# Altium schematic sheet EEPROM.SchDoc: Dahlia Carrier Board
size A3; Organization: Toradex AG; Address1: Ebenaustrasse 10; Address2: Horw; Address3: 6048; Address4: Switzerland; DocumentNumber: 16; Revision: V1.1; SheetNumber: 16; SheetTotal: 21; PageSetup: Record=PageOptions|CenterHorizontal=True|CenterVertical=True|PrintScale=0.71|XCorrection=1.00|YCorrection=1.00|PrintKind=1|BorderSize=5000000|LeftOffset=0|BottomOffset=0|Orientation=2|PaperLength=1000|PaperWidth=1000|Scale=100|PaperSource=15|PrintQuality=600|MediaType=1|DitherType=10|PaperKind=A4|PrintScaleMode=1
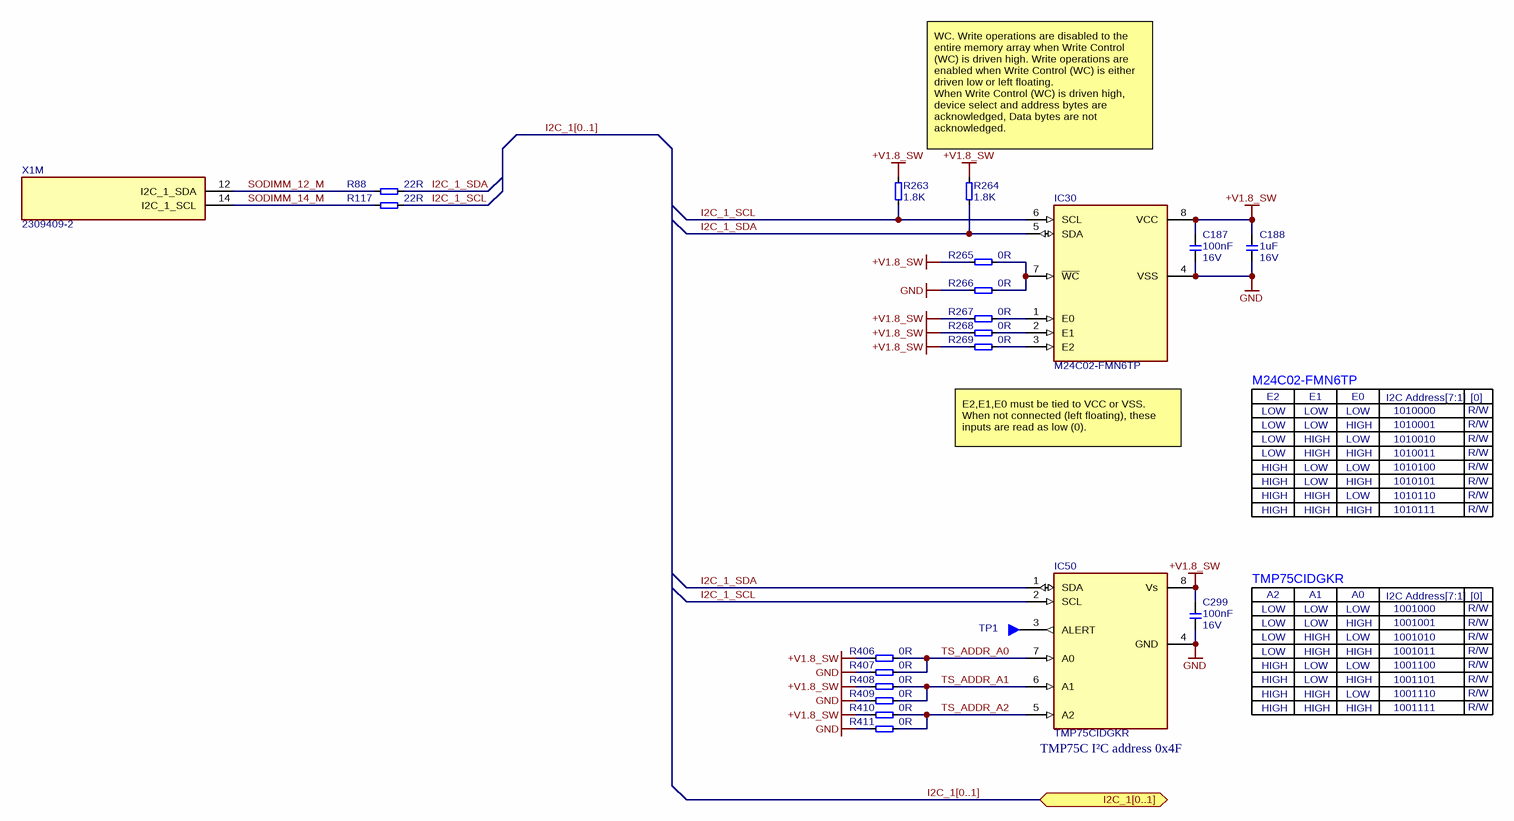
[diagram p0: EEPROM.SchDoc]

## Parts
C187  Rating: 16V  [CAPC1005X60N]  (hidden comment: 100nF)
C188  Rating: 16V  [CAPC1005X60N]  (hidden comment: 1uF)
C299  Rating: 16V  [CAPC1005X60N]  (hidden comment: 100nF)
IC30  M24C02-FMN6TP  [IC-SOIC-8N]
IC50  TMP75CIDGKR  [IC-TSOP65P490X110-8N]
R88  22R  [RESC1005X40N]
R117  22R  [RESC1005X40N]
R263  1.8K  [RESC1005X40N]
R264  1.8K  [RESC1005X40N]
R265  0R  [T_RESC0603X30N]
R266  0R  [T_RESC0603X30N]
R267  0R  [T_RESC0603X30N]
R268  0R  [T_RESC0603X30N]
R269  0R  [T_RESC0603X30N]
R406  0R  [T_RESC0603X30N]
R407  0R  [T_RESC0603X30N]
R408  0R  [T_RESC0603X30N]
R409  0R  [T_RESC0603X30N]
R410  0R  [T_RESC0603X30N]
R411  0R  [T_RESC0603X30N]
TP1  Testpin-SMD  [T_TP-SMD]  (value not drawn)  (no BOM)
X1  2309409-2  [CON-TE-2309409-2-SOLDERABLE-STANDOFFS]  (part M of 23)

## Ports
I2C_1[0..1] (bidir)

## Nets
+V1.8_SW: C187.2 C188.2 C299.2 IC30.8(VCC) IC50.8(Vs) R263.1 R264.1 R265.1 R267.1 R268.1 R269.1 R406.1 R408.1 R410.1
GND: C187.1 C188.1 C299.1 IC30.4(VSS) IC50.4(GND) R266.1 R407.1 R409.1 R411.1
I2C_1_SCL: IC30.6(SCL) IC50.2(SCL) R117.2 R263.2
I2C_1_SDA: IC30.5(SDA) IC50.1(SDA) R88.2 R264.2
SODIMM_12_M: R88.1 X1.12(I2C_1_SDA)
SODIMM_14_M: R117.1 X1.14(I2C_1_SCL)
TS_ADDR_A0: IC50.7(A0) R406.2 R407.2
TS_ADDR_A1: IC50.6(A1) R408.2 R409.2
TS_ADDR_A2: IC50.5(A2) R410.2 R411.2
NetIC30_1: IC30.1(E0) R267.2
NetIC30_2: IC30.2(E1) R268.2
NetIC30_3: IC30.3(E2) R269.2
NetIC30_7: IC30.7(~{WC}) R265.2 R266.2
NetIC50_3: IC50.3(ALERT) TP1.1

## Buses and harness runs
bus I2C_1[0..1] = port I2C_1[0..1]

## Notes on the sheet
- WC. Write operations are disabled to the entire memory array when Write Control (WC) is driven high. Write operations are enabled when Write Control (WC) is either driven low or left floating.
  When Write Control (WC) is driven high, device select and address bytes are acknowledged, Data bytes are not acknowledged.
- E2,E1,E0 must be tied to VCC or VSS. When not connected (left floating), these inputs are read as low (0).
- M24C02-FMN6TP
- LOW
- E2
- HIGH
- E1
- E0
- I2C Address[7:1]
- 1010000
- 1010001
- 1010010
- R/W
- [0]
- 1010011
- 1010100
- 1010101
- 1010110
- 1010111
- TMP75CIDGKR
- A2
- A1
- A0
- 1001000
- 1001001
- 1001010
- 1001011
- 1001100
- 1001101
- 1001110
- 1001111
- (near IC50) TMP75C I²C address 0x4F
- Title
- Size:
- Date:
- A3
- Number:
- Time:
- Revision:
- Sheet
- of
- File:

## Library data of the parts
C187 C299 = C-X7R-100nF-16V-10%-0402: Capacitor Ceramic X7R 100nF 16V 10% 0402; Tolerance: 10%; Type: X7R; Value: 100nF
C188 = C-X5R-1uF-16V-20%-0402: Capacitor Ceramic X5R 1uF 16V 20% 0402; Tolerance: 20%; Type: X5R; Value: 1uF
IC30 = IC-ST-M24C02-FMN6TP: EEPROM, Serial I²C bus , SOIC-8, -40C to +85C; Manufacturer Name: ST; Temperature Range: -40C to +85C; Package: SOIC-8 (3.9mm x4.9 mm); Manufacturer Part No.: M24C02-FMN6TP
IC50 = IC-TI-TMP75CIDGKR: Temperature Sensor Digital, Local -55°C ~ 125°C 11 b 8-VSSOP; Manufacturer Name: Texas Instruments; Manufacturer Part No.: TMP75CIDGKR
R88 R117 = R-22R-63mW-5%-0402: Resistor 22 ohm 63mW 5% 0402; Rating: 63mW; Tolerance: 5%; Value: 22R
R263 R264 = R-1.8K-63mW-5%-0402: Resistor 1.8 Kohm 63mW 5% 0402; Rating: 63mW; Tolerance: 5%; Value: 1.8K
R265-R269 R406-R411 = R-0R-63mW-1%-0603: Resistor 0 ohm 63mW 1% 0603; Rating: 63mW; Tolerance: 1%; Value: 0R
TP1 = Testpin-SMD: Testpin SMD
X1 = CON-TE-2309409-2: DDR4 SODIMM Socket, 260 pins, 5.2mm(H), 0.5mm Pitch; Manufacturer Name: TE; Temperature Range: -40C to +125C; Package: DDR4-SODIMM-260; Manufacturer Part No.: 2309409-2